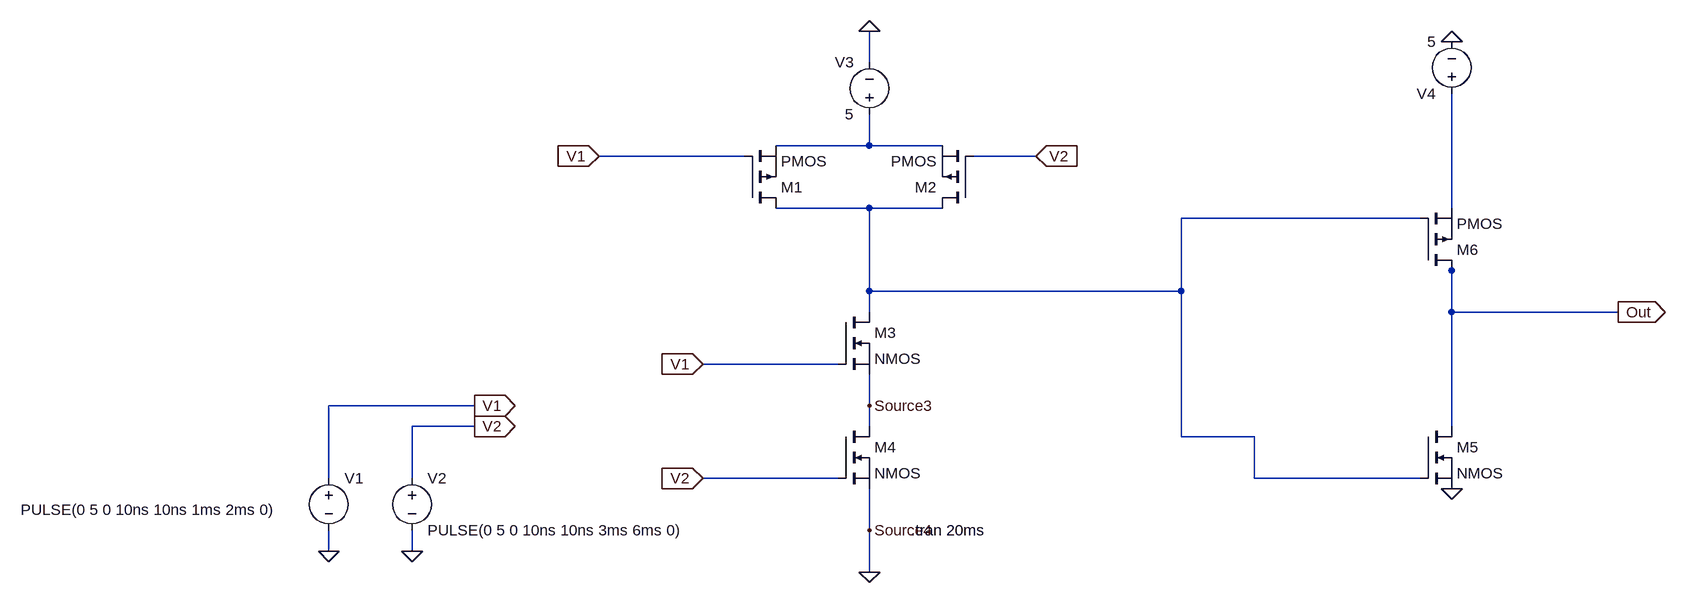
[diagram p0: schematic TP7_PORT_AND_CASCADE.asc]
TP7_PORT_AND_CASCADE.asc, the LTspice schematic file:
Version 4
SHEET 1 1748 756
WIRE 496 -256 496 -304
WIRE 496 -128 496 -176
WIRE 496 -128 352 -128
WIRE 608 -128 496 -128
WIRE 304 -112 80 -112
WIRE 752 -112 656 -112
WIRE 496 -32 352 -32
WIRE 608 -32 496 -32
WIRE 1392 -32 1392 -208
WIRE 1344 -16 976 -16
WIRE 1392 64 1392 48
WIRE 496 96 496 -32
WIRE 976 96 976 -16
WIRE 976 96 496 96
WIRE 496 128 496 96
WIRE 1392 128 1392 64
WIRE 1648 128 1392 128
WIRE 448 208 240 208
WIRE -112 272 -336 272
WIRE 496 272 496 224
WIRE -112 304 -208 304
WIRE 496 304 496 272
WIRE 1392 304 1392 128
WIRE 976 320 976 96
WIRE 1088 320 976 320
WIRE -336 384 -336 272
WIRE -208 384 -208 304
WIRE 448 384 240 384
WIRE 1088 384 1088 320
WIRE 1344 384 1088 384
WIRE 496 464 496 400
WIRE -336 496 -336 464
WIRE -208 496 -208 464
WIRE 496 528 496 464
FLAG -336 496 0
FLAG -208 496 0
FLAG 496 -304 0
FLAG 496 528 0
FLAG 1648 128 Out
IOPIN 1648 128 Out
FLAG -112 272 V1
IOPIN -112 272 Out
FLAG -112 304 V2
IOPIN -112 304 Out
FLAG 80 -112 V1
IOPIN 80 -112 In
FLAG 752 -112 V2
IOPIN 752 -112 In
FLAG 240 384 V2
IOPIN 240 384 In
FLAG 496 272 Source3
FLAG 496 464 Source4
FLAG 240 208 V1
IOPIN 240 208 In
FLAG 1392 400 0
FLAG 1392 -288 0
SYMBOL voltage -336 368 R0
WINDOW 3 -474 64 Left 2
WINDOW 123 0 0 Left 0
WINDOW 39 0 0 Left 0
SYMATTR Value PULSE(0 5 0 10ns 10ns 1ms 2ms 0)
SYMATTR InstName V1
SYMBOL voltage -208 368 R0
WINDOW 123 0 0 Left 0
WINDOW 39 0 0 Left 0
SYMATTR InstName V2
SYMATTR Value PULSE(0 5 0 10ns 10ns 3ms 6ms 0)
SYMBOL voltage 496 -160 R180
WINDOW 0 24 96 Left 2
WINDOW 3 24 16 Left 2
WINDOW 123 0 0 Left 0
WINDOW 39 0 0 Left 0
SYMATTR InstName V3
SYMATTR Value 5
SYMBOL pmos 304 -32 M180
SYMATTR InstName M1
SYMBOL pmos 656 -32 R180
SYMATTR InstName M2
SYMBOL nmos 448 128 R0
SYMATTR InstName M3
SYMBOL nmos 448 304 R0
SYMATTR InstName M4
SYMBOL nmos 1344 304 R0
SYMATTR InstName M5
SYMBOL pmos 1344 64 M180
SYMATTR InstName M6
SYMBOL voltage 1392 -192 R180
WINDOW 123 0 0 Left 0
WINDOW 39 0 0 Left 0
SYMATTR InstName V4
SYMATTR Value 5
TEXT 560 464 Left 2 !.tran 20ms

The netlist it stands for:
* TP7_PORT_AND_CASCADE.asc
V1 V1 0 PULSE(0 5 0 10ns 10ns 1ms 2ms 0)
V2 V2 0 PULSE(0 5 0 10ns 10ns 3ms 6ms 0)
V3 N001 0 5
M1 N002 V1 N001 N001 PMOS
M2 N002 V2 N001 N001 PMOS
M3 N002 V1 Source3 Source3 NMOS
M4 Source3 V2 0 0 NMOS
M5 Out N002 0 0 NMOS
M6 Out N002 N003 N003 PMOS
V4 N003 0 5
.model NMOS NMOS
.model PMOS PMOS
.lib standard.mos
.tran 20ms
.backanno
.end